# Altium schematic sheet USB.SchDoc
size A3
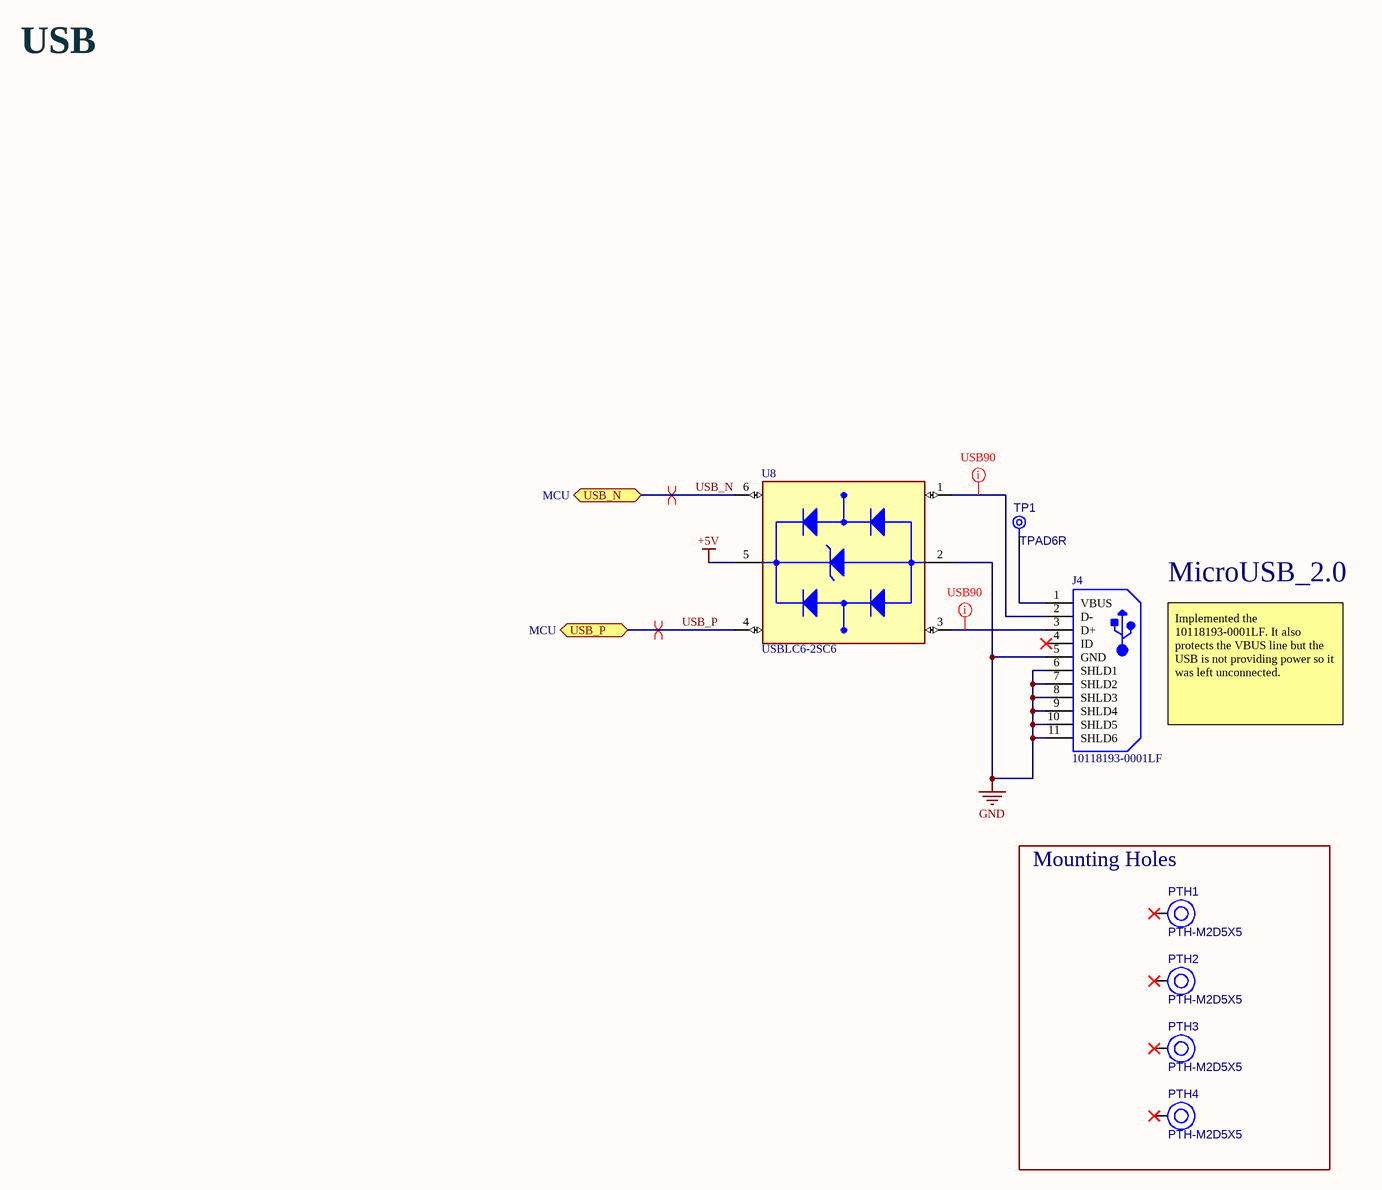
[diagram p0: USB.SchDoc]

## Parts
J4  10118193-0001LF  [FCI-10118193-0001LF-5_V]
PTH1  PTH-M2D5X5  [PTH-M2D5X5]
PTH2  PTH-M2D5X5  [PTH-M2D5X5]
PTH3  PTH-M2D5X5  [PTH-M2D5X5]
PTH4  PTH-M2D5X5  [PTH-M2D5X5]
TP1  TPAD6R  [TP06R]  (no BOM)
U8  USBLC6-2SC6  [SOT95P280X145-6N]

## Blocks framed on the sheet
Mounting Holes: PTH1-PTH4

## Ports
USB_N (bidir, see MCU), USB_P (bidir, see MCU)

## Nets
+5V: U8.5(VBUS)
GND: J4.5(GND) J4.6(SHLD1) J4.7(SHLD2) J4.8(SHLD3) J4.9(SHLD4) J4.10(SHLD5) J4.11(SHLD6) U8.2(GND)
USB_N: U8.6(I/O1_OUT) ; port USB_N
USB_P: U8.4(I/O2_OUT) ; port USB_P
NetJ4_1: J4.1(VBUS) TP1.1(TP)
NetJ4_2: J4.2(D-) U8.1(I/O1_IN)
NetJ4_3: J4.3(D+) U8.3(I/O2_IN)

Not connected (* = marked no-connect by the designer): J4 4(ID)*; PTH1 1(H1)*; PTH2 1(H1)*; PTH3 1(H1)*; PTH4 1(H1)*

## Layout directives
differential pair: USB_N, USB_P
net class USB90: NetJ4_2, NetJ4_3

## Notes on the sheet
- USB
- MicroUSB_2.0
- Implemented the 10118193-0001LF. It also protects the VBUS line but the USB is not providing power so it was left unconnected.

## Library data of the parts
J4 = CMP-2000-05119-1: Micro USB B Type Receptacle, -55 to 85 degC, 5-Pin SMD, RoHS, Tape and Reel; Manufacturer: FCI; Insulation Resistance: 1000MOhms; Gender: Female; Current Rating: 1.8A; Number of Contacts: 5Contact; Connector Type: MicroUSBTypeBreceptacle; Mounting Angle: Right; Datasheet Version: Rev. C, 05/2015; Packaging: Reel; Product Category: USBConnectors; Standard: USB2.0; Factory Pack Quantity: 1200; Operating Temperature Range: -55Cto+85C; Termination Style: SMD/SMT; Datasheet URL: http://datasheet.octopart.com/10118193-0001LF-FCI-datasheet-55953155.pdf; Contact Material: CopperAlloy; RoHS: Details; Contact Plating: Gold; Flammability Rating: UL94V-0; Manufacturer URL: http://www.fci.com/; Brand: FCI; Product: MicroUSBTypeBConnectors; Color: Black
PTH1-PTH4 = CMP-00028-00004-2: M2 PTH (2.5mm), 5mm pad; Pins: 1
TP1 = CMP-00028-00002-2: 0.6mm round; Pins: 1
U8 = CMP-004-00031-1: 17V Clamp 5A (8/20Âµs) Ipp Tvs Diode Surface Mount SOT-23-6; MF: STMicroelectronics; Case/Package: SOT-23-6 STMicroelectronics; Component Type: Standard; Availability: In Stock; Design Item ID: USBLC6-2SC6; Pins: 6; Source: USBLC6-2SC6.SchLib; Purchase-URL: https://pricing.snapeda.com/search/part/USBLC6-2SC6/?ref=eda; MP: USBLC6-2SC6; Check_prices: https://www.snapeda.com/parts/USBLC6-2SC6/STMicroelectronics/view-part/?ref=eda; Value: *; Price: None; SnapEDA_Link: https://www.snapeda.com/parts/USBLC6-2SC6/STMicroelectronics/view-part/?ref=snap